# EasyEDA Pro project STM32VG.eprj

# Schematic STM32VG

## Sheets
1 Core: Board Name: STM32VG; Create Date: 2023-02-07; Page Name: Core; Project Name: STM32VG; Schematic Name: STM32VG; Update Date: 2025-08-18; Company: 嘉立创EDA; Page Size: A4; Version: V1.0
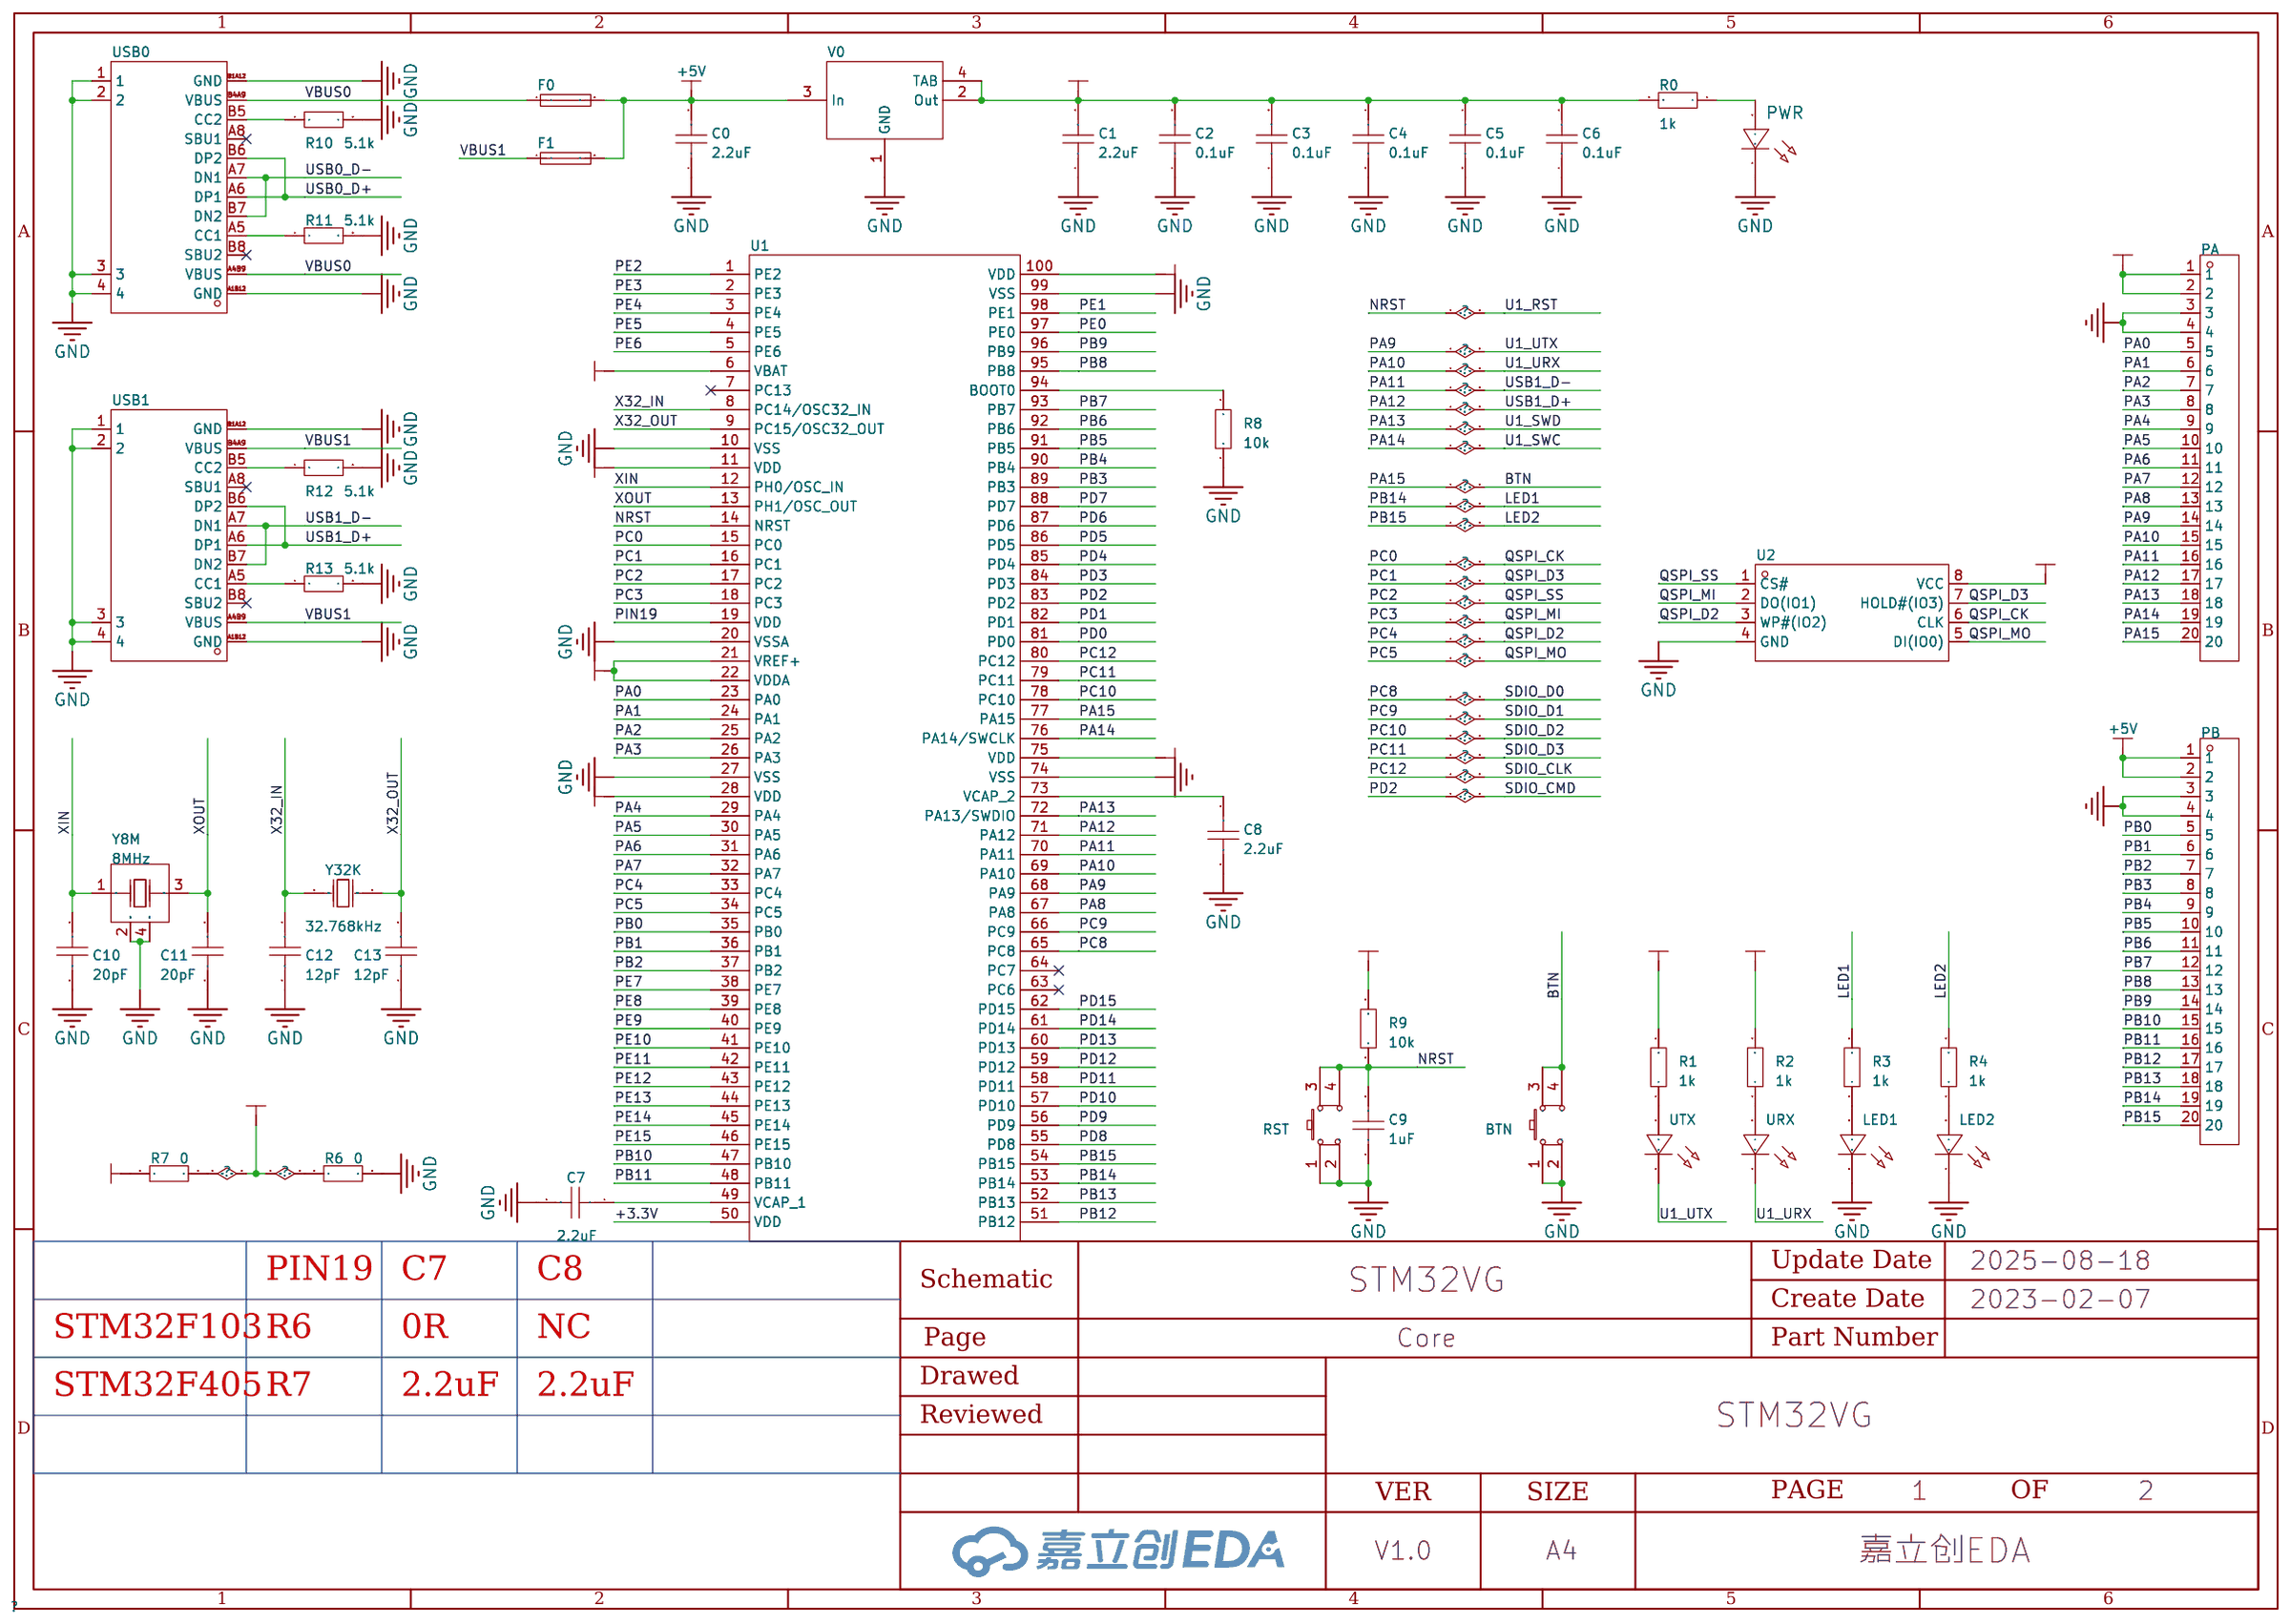
[diagram p0: Core]
2 Peripheral: Page Name: Peripheral
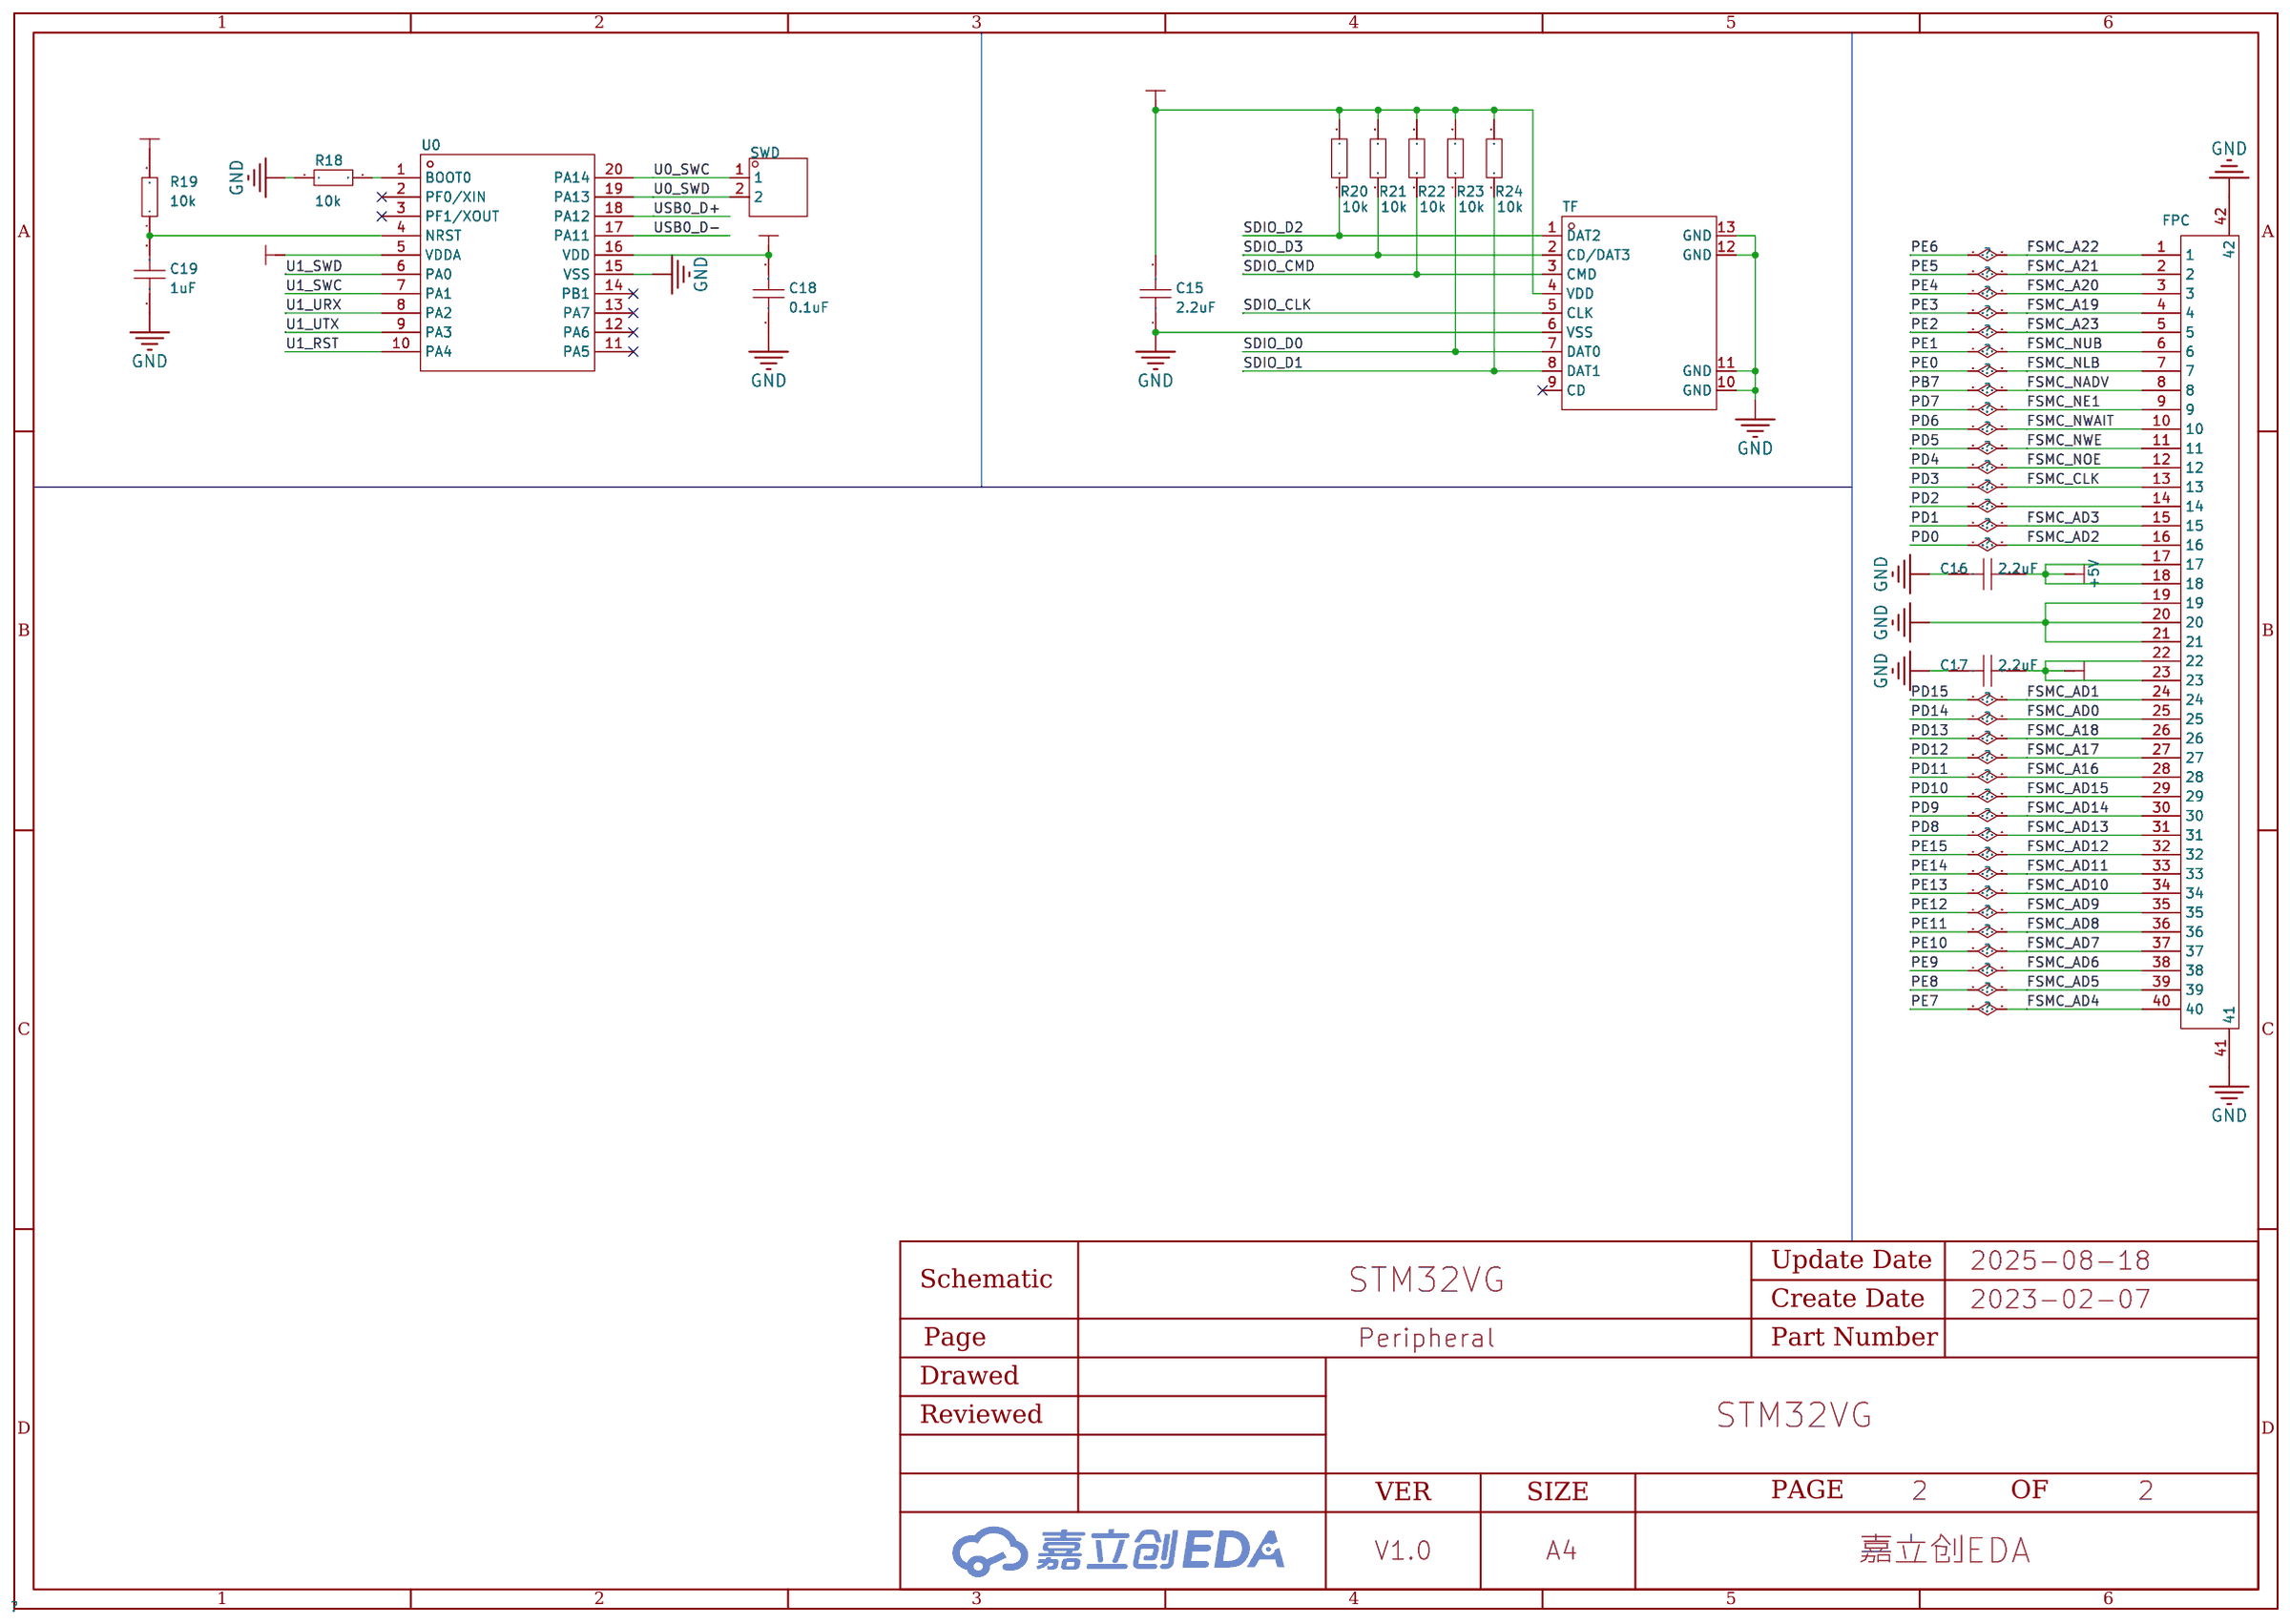
[diagram p1: Peripheral]

## Parts
sheet Core
BTN  PTS815SJK250SMTRLFS  [SW-SMD_4P-L4.2-W3.3-P2.15-LS5.1]
C0  2.2uF  [C0603]
C1  2.2uF  [C0603]
C2  0.1uF  [C0603]
C3  0.1uF  [C0603]
C4  0.1uF  [C0603]
C5  0.1uF  [C0603]
C6  0.1uF  [C0603]
C7  2.2uF  [C0603]
C8  2.2uF  [C0603]
C9  1uF  [C0603]
C10  20pF  [C0603]
C11  20pF  [C0603]
C12  12pF  [C0603]
C13  12pF  [C0603]
F0  JK-nSMD100-16  [F1206]
F1  JK-nSMD100-16  [F1206]
LED1  -  [LED0603-RD_BLUE]
LED2  -  [LED0603-RD_BLUE]
PA  -  [HDR-TH_20P-P2.54-V-M-1]
PB  -  [HDR-TH_20P-P2.54-V-M-1]
PWR  -  [LED0603-RD_BLUE]
R0  1k  [R0603]
R1  1k  [R0603]
R2  1k  [R0603]
R3  1k  [R0603]
R4  1k  [R0603]
R6  0  [R0603]
R7  0  [R0603]
R8  10k  [R0603]
R9  10k  [R0603]
R10  5.1k  [R0603]
R11  5.1k  [R0603]
R12  5.1k  [R0603]
R13  5.1k  [R0603]
RST  PTS815SJK250SMTRLFS  [SW-SMD_4P-L4.2-W3.3-P2.15-LS5.1]
U1  STM32F405VGT6  [LQFP-100_L14.0-W14.0-P0.50-LS16.0-BL]
U2  W25Q64JVSSIQ  [SOIC-8_L5.3-W5.3-P1.27-LS8.0-BL]
URX  -  [LED0603-RD]
USB0  USB-TYPE-C-017  [USB-TYPE-C-SMD_C9900008089]
USB1  USB-TYPE-C-017  [USB-TYPE-C-SMD_C9900008089]
UTX  -  [LED0603-RD]
V0  1117-3.3  [SOT-223-3_L6.4-W3.5-P2.30-LS7.0-BR]
Y8M  8MHz  [CRYSTAL-SMD_4P-L3.2-W2.5-BL]
Y32K  32.768kHz  [OSC-SMD_L3.2-W1.5]
sheet Peripheral
C15  2.2uF  [C0603]
C16  2.2uF  [C0603]
C17  2.2uF  [C0603]
C18  0.1uF  [C0603]
C19  1uF  [C0603]
FPC  AFC01-S40FCA-00  [FPC-SMD_P0.50-40P_FGS-XJ-H2.0]
R18  10k  [R0603]
R19  10k  [R0603]
R20  10k  [R0603]
R21  10k  [R0603]
R22  10k  [R0603]
R23  10k  [R0603]
R24  10k  [R0603]
SWD  -  [HDR-TH_2P-P2.54-V-M-1]
TF  TF-01  [TF-SMD_TF-02]
U0  -  [TSSOP-20_L6.5-W4.4-P0.65-LS6.4-BL]

## Library data of the parts
BTN RST = PTS815SJK250SMTRLFS: 操作寿命10万次，使用温度-20°C 至 70°C,尺寸4.20mmx3.20mmx2.50mm，操作力度2.5N; LCSC Part Name: 轻触开关; Supplier Part: C918859; Manufacturer: C&K; Supplier Footprint: SMD; JLCPCB Part Class: 扩展库; Datasheet: https://atta.szlcsc.com/upload/public/pdf/source/20190916/C411883_4F77F16E1D8E48DC707D8949CEE7CF80.pdf; Supplier: LCSC
C0-C13 C15-C19 = CAP_0603: 容值:100nF;精度:±10%;额定电压:50V;温度系数:X7R;; Supplier Footprint: 0603
F0 F1 = JK-nSMD100-16: LCSC Part Name: 16V 1A 1206自恢复; Supplier Part: C369161; Manufacturer: JK(金科); Supplier Footprint: 1206; JLCPCB Part Class: 扩展库; Datasheet: https://atta.szlcsc.com/upload/public/pdf/source/20190807/C409806_27B0F7EFFA3D5CEE60CCD1EE0A933E0A.pdf; Supplier: LCSC; Voltage - Max: 16V; Current - Max: 100A; Hold Current: 1A; Trip Current: 1.8A; Time to Trip(Max): 300ms
LED1 LED2 = LED_0603-B: 照明颜色:蓝色;主波长/色坐标:465~475nm;; Supplier Footprint: 0603; Supplier Part: C72041
PA PB = HDR-M_2.54_1x20P: 间距:2.54mm;总PIN位数:20;排数:1;插针结构:-;行距:-;安装类型:直插;圆针/方针:-;额定电流:-;额定电压:-;配合针长度:-;塑高:-;触头材质:黄铜;触头镀层:-;颜色:黑色;; Supplier Part: C50981; Supplier Footprint: 插件
PWR = LED_0603-R: 发光颜色:红灯;二极管配置:-;透镜颜色:无色透明;主波长:617.5nm;峰值波长:632nm;色温:-;光通量(25时):-;测试电流:5mA;正向电压(VF):2.2V;发光强度:28.5mcd;功率:60mW;发光角度:120°;安装方式:-;工作温度:-40~+85;; Supplier Footprint: 0603; Supplier Part: C72044
R0-R4 R6-R13 R18-R24 = Res_0603: Supplier Footprint: 0603
U1 = STM32F405VG: CPU内核:ARM Cortex-M4;CPU最大主频:168MHz;工作电压范围:1.8V~3.6V;内部振荡器:有;程序 FLASH容量:1MB;RAM总容量:192KB;EEPROM/数据 FLASH容量:-;GPIO端口数量:82;ADC(单元数/通道数/位数):1@x16ch/12bit;DAC(单元数/通道数/位数):1@x2ch/12bit;外设/功能/协议栈:DMA；LCD/LED驱动；PWM；看门狗;工作温度范围:-40℃~+85℃;; LCSC Part Name: ARM Cortex-M4 168MHz 闪存：1MB RAM：192KB; Supplier Part: C56621; Manufacturer: ST(意法半导体); Supplier Footprint: LQFP-100(14x14); JLCPCB Part Class: 扩展库; Datasheet: https://atta.szlcsc.com/upload/public/pdf/source/20150910/1457707351424.pdf; Supplier: LCSC; CPU Core: ARM Cortex-M4; Maximum Frequency: 168MHz; Supply Voltage Range: 1.8V~3.6V; Internal Oscillator: 有; Program FLASH Size: 1MB; RAM Size: 192KB; GPIO Ports Number: 82; ADC (Units/Channels/bits): 1@x16ch/12bit; DAC (Units/Channels/bits): 1@x2ch/12bit; Peripherals / Functions / Protocol Stacks: DMA；LCD/LED驱动；PWM；看门狗; Operating Temperature Range: -40℃~+85℃
U2 = W25Q64JVSS: Supplier Part: C179171; Manufacturer: WINBOND(华邦); Supplier Footprint: SOIC-8-208mil; JLCPCB Part Class: 扩展库; Datasheet: https://atta.szlcsc.com/upload/public/pdf/source/20191218/C179171_92C5C91D0324539EDD8F1160D2E79C0F.pdf; Supplier: LCSC
URX UTX = LED_0603-G: 照明颜色:翠绿;色温 - CCT（K）:-;主波长/色坐标:520~535nm;; Supplier Footprint: 0603; Supplier Part: C72043
USB0 USB1 = USB-TYPE-C-017: 连接器类型:Type-C;标准:-;公母:母座;触点数量:16;端口数量:1;安装方式:卧贴;额定电流 - 电源:3A;工作温度范围:-25~+85;; Supplier Part: C2927037; Manufacturer: DEALON(德艺隆); Supplier Footprint: SMD; JLCPCB Part Class: 扩展库; Datasheet: https://atta.szlcsc.com/upload/public/pdf/source/20211217/653222EE5174722C9DFE2966329956D8.pdf; Supplier: LCSC; Connector Type: Type-C; Gender: 母座; Number of Contacts: 16; Number of Ports: 1; Mounting Style: 卧贴; Current Rating - Power (Max): 3A; Operating Temperature Range: -25~+85
V0 = AMS1117-3.3: LCSC Part Name: 三端稳压器; Supplier Part: C5125088; Manufacturer: IDCHIP(英锐芯); Supplier Footprint: SOT-223; JLCPCB Part Class: 扩展库; Datasheet: https://atta.szlcsc.com/upload/public/pdf/source/20220816/063B23F8025063688804E1CFFCDD269A.pdf; Supplier: LCSC
Y8M = X32258MSB4SI: 频率:8MHz;频率公差:±10ppm;负载电容:20pF;; LCSC Part Name: 8MHz ±10ppm 20pF YSX321SL; Supplier Part: C2682774; Manufacturer: YXC(扬兴晶振); Supplier Footprint: SMD3225-4P; JLCPCB Part Class: 扩展库; Datasheet: https://atta.szlcsc.com/upload/public/pdf/source/20210106/C2682774_0CD4FDA5D9DA3FBEEC23BD607A48E4B0.pdf; Supplier: LCSC; Crystal Type: 贴片无源晶振; Frequency Tolerance: ±10ppm; Frequency Stability: ±30ppm; Load Capacitance: 20pF; Operating Temperature: -40℃~+85℃
Y32K = 7LC32768F12UC: 工作温度:-40~+85;工作温度:-40~+85;频率:32.768kHz;负载电容:12.5pF;晶振类型:贴片无源晶振;频率公差:±20ppm;频率公差:±20ppm;等效串联电阻(ESR):70kΩ;; LCSC Part Name: 32.768KHZ 12.5PF  ±20ppm; Supplier Part: C252398; Manufacturer: SJK(晶科鑫); Supplier Footprint: SMD-3215_2P; JLCPCB Part Class: 扩展库; Datasheet: https://atta.szlcsc.com/upload/public/pdf/source/20180725/C252398_B09721EBC402D2F46F4FCA4EBDD60A31.pdf; Supplier: LCSC; Operating Temperature: -40~+85; Load Capacitance: 12.5pF; Crystal Type: 贴片无源晶振; Frequency Tolerance: ±20ppm; Equivalent Series Resistance (ESR): 70kΩ
FPC = AFC01-S40FCA-00: 间距:0.5mm;触点数量:40;锁定特性:翻盖式;安装类型:卧贴;触点类型:下接;; LCSC Part Name: FPC 0.5MM 40P 翻盖式 H2.0mm 下接; Supplier Part: C262674; Manufacturer: JS(钜硕电子); Supplier Footprint: P=0.5mm; JLCPCB Part Class: 扩展库; Datasheet: https://atta.szlcsc.com/upload/public/pdf/source/20180814/C262674_1AF28B4A53C394BA00EA1A6141614455.pdf; Supplier: LCSC; Pitch: 0.5mm; Number of Contacts: 40; Locking Feature: 翻盖式; Mounting Type: 卧贴; Contact Type: 下接; Height Above Board: 2mm; FFC, FCB Thickness: 0.3mm~0.3mm
SWD = HDR-M_2.54_1x2P: Supplier Part: C124375; Supplier Footprint: 插件
TF = TF-01: 卡连接方式:自弹式;卡类型:MicroSD卡(TF卡);连接器类型:卡座;本体最大高度:2mm;工作温度范围:-;; LCSC Part Name: 自弹式 MicroSD卡(TF卡) 卡座 9P外焊 端子镀金; Supplier Part: C2889257; Manufacturer: Yuandi(台湾元迪); Supplier Footprint: SMD; JLCPCB Part Class: 扩展库; Datasheet: https://atta.szlcsc.com/upload/public/pdf/source/20210830/04E8B8B371F2BAAE2FD01F5A99E06D9E.pdf; Supplier: LCSC; Card Connection Mode: 自弹式; Card Type: MicroSD卡(TF卡); Connector Type: 卡座; Maximum Body Height: 2mm
U0 = AT32F425F8

## Nets
+3.3V: C1.2 C2.2 C3.2 C4.1 C5.1 C6.2 C15.2 C17.2 C18.2 FPC.22 FPC.23 PA.1 PA.2 R0.2 R1.2 R2.2 R7.2 R9.2 R19.2 R20.2 R21.2 R22.2 R23.2 R24.2 TF.4(VDD) U0.5(VDDA) U0.16(VDD) U1.6(VBAT) U1.11(VDD) U1.21(VREF+) U1.22(VDDA) U1.28(VDD) U1.50(VDD) U1.75(VDD) U1.100(VDD) U2.8(VCC) V0.2(Out) V0.4(TAB)
+5V: C0.2 C16.2 F0.2 F1.2 FPC.17 FPC.18 PB.1 PB.2 V0.3(In)
GND: BTN.1 BTN.2 C0.1 C1.1 C2.1 C3.1 C4.2 C5.2 C6.1 C7.2 C8.1 C9.1 C10.2 C11.1 C12.2 C13.1 C15.1 C16.1 C17.1 C18.1 C19.1 FPC.19 FPC.20 FPC.21 FPC.41 FPC.42 LED1.1(C) LED2.1(C) PA.3 PA.4 PB.3 PB.4 PWR.1(C) R6.2 R8.1 R10.2 R11.2 R12.2 R13.2 R18.1 RST.1 RST.2 TF.6(VSS) TF.10(GND) TF.11(GND) TF.12(GND) TF.13(GND) U0.15(VSS) U1.10(VSS) U1.20(VSSA) U1.27(VSS) U1.74(VSS) U1.99(VSS) U2.4(GND) USB0.1 USB0.2 USB0.3 USB0.4 USB0.A1B12(GND) USB0.B1A12(GND) USB1.1 USB1.2 USB1.3 USB1.4 USB1.A1B12(GND) USB1.B1A12(GND) V0.1(GND) Y8M.2(GND) Y8M.4(GND)
VBUS0: F0.1 USB0.A4B9(VBUS) USB0.B4A9(VBUS)
VBUS1: F1.1 USB1.A4B9(VBUS) USB1.B4A9(VBUS)
BTN: BTN.3 BTN.4 PA.20 U1.77(PA15)
FSMC_A16: FPC.28 U1.58(PD11)
FSMC_A17: FPC.27 U1.59(PD12)
FSMC_A18: FPC.26 U1.60(PD13)
FSMC_A19: FPC.4 U1.2(PE3)
FSMC_A20: FPC.3 U1.3(PE4)
FSMC_A21: FPC.2 U1.4(PE5)
FSMC_A22: FPC.1 U1.5(PE6)
FSMC_A23: FPC.5 U1.1(PE2)
FSMC_AD0: FPC.25 U1.61(PD14)
FSMC_AD1: FPC.24 U1.62(PD15)
FSMC_AD2: FPC.16 U1.81(PD0)
FSMC_AD3: FPC.15 U1.82(PD1)
FSMC_AD4: FPC.40 U1.38(PE7)
FSMC_AD5: FPC.39 U1.39(PE8)
FSMC_AD6: FPC.38 U1.40(PE9)
FSMC_AD7: FPC.37 U1.41(PE10)
FSMC_AD8: FPC.36 U1.42(PE11)
FSMC_AD9: FPC.35 U1.43(PE12)
FSMC_AD10: FPC.34 U1.44(PE13)
FSMC_AD11: FPC.33 U1.45(PE14)
FSMC_AD12: FPC.32 U1.46(PE15)
FSMC_AD13: FPC.31 U1.55(PD8)
FSMC_AD14: FPC.30 U1.56(PD9)
FSMC_AD15: FPC.29 U1.57(PD10)
FSMC_CLK: FPC.13 U1.84(PD3)
FSMC_NADV: FPC.8 PB.12 U1.93(PB7)
FSMC_NE1: FPC.9 U1.88(PD7)
FSMC_NLB: FPC.7 U1.97(PE0)
FSMC_NOE: FPC.12 U1.85(PD4)
FSMC_NUB: FPC.6 U1.98(PE1)
FSMC_NWAIT: FPC.10 U1.87(PD6)
FSMC_NWE: FPC.11 U1.86(PD5)
LED1: PB.19 R3.2 U1.53(PB14)
LED2: PB.20 R4.2 U1.54(PB15)
NRST: C9.2 R9.1 RST.3 RST.4 U0.10(PA4) U1.14(NRST)
PA0: PA.5 U1.23(PA0)
PA1: PA.6 U1.24(PA1)
PA2: PA.7 U1.25(PA2)
PA3: PA.8 U1.26(PA3)
PA4: PA.9 U1.29(PA4)
PA5: PA.10 U1.30(PA5)
PA6: PA.11 U1.31(PA6)
PA7: PA.12 U1.32(PA7)
PA8: PA.13 U1.67(PA8)
PA9: PA.14 U0.9(PA3) U1.68(PA9) UTX.1(C)
PA10: PA.15 U0.8(PA2) U1.69(PA10) URX.1(C)
PA11: PA.16 U1.70(PA11) USB1.A7(DN1) USB1.B7(DN2)
PA12: PA.17 U1.71(PA12) USB1.A6(DP1) USB1.B6(DP2)
PA13: PA.18 U0.6(PA0) U1.72(PA13/SWDIO)
PA14: PA.19 U0.7(PA1) U1.76(PA14/SWCLK)
PB0: PB.5 U1.35(PB0)
PB1: PB.6 U1.36(PB1)
PB2: PB.7 U1.37(PB2)
PB3: PB.8 U1.89(PB3)
PB4: PB.9 U1.90(PB4)
PB5: PB.10 U1.91(PB5)
PB6: PB.11 U1.92(PB6)
PB8: PB.13 U1.95(PB8)
PB9: PB.14 U1.96(PB9)
PB10: PB.15 U1.47(PB10)
PB11: PB.16 U1.48(PB11)
PB12: PB.17 U1.51(PB12)
PB13: PB.18 U1.52(PB13)
PC0: U1.15(PC0) U2.6(CLK)
PC1: U1.16(PC1) U2.7(HOLD#(IO3))
PC2: U1.17(PC2) U2.1(CS#)
PC3: U1.18(PC3) U2.2(DO(IO1))
PC4: U1.33(PC4) U2.3(WP#(IO2))
PC5: U1.34(PC5) U2.5(DI(IO0))
PC8: R23.1 TF.7(DAT0) U1.65(PC8)
PC9: R24.1 TF.8(DAT1) U1.66(PC9)
PC10: R20.1 TF.1(DAT2) U1.78(PC10)
PC11: R21.1 TF.2(CD/DAT3) U1.79(PC11)
PC12: TF.5(CLK) U1.80(PC12)
PD2: FPC.14 R22.1 TF.3(CMD) U1.83(PD2)
PIN19: R6.1 R7.1 U1.19(VDD)
U0_SWC: SWD.1 U0.20(PA14)
U0_SWD: SWD.2 U0.19(PA13)
USB0_D+: U0.18(PA12) USB0.A6(DP1) USB0.B6(DP2)
USB0_D-: U0.17(PA11) USB0.A7(DN1) USB0.B7(DN2)
X32_IN: C12.1 U1.8(PC14/OSC32_IN) Y32K.1(OSC1)
X32_OUT: C13.2 U1.9(PC15/OSC32_OUT) Y32K.2(OSC2)
XIN: C10.1 U1.12(PH0/OSC_IN) Y8M.1(OSC1)
XOUT: C11.2 U1.13(PH1/OSC_OUT) Y8M.3(OSC2)
$1N5592: R11.1 USB0.A5(CC1)
$1N5593: R10.1 USB0.B5(CC2)
$1N5603: PWR.2(A) R0.1
$1N5607: R13.1 USB1.A5(CC1)
$1N5608: R12.1 USB1.B5(CC2)
$1N5646: C7.1 U1.49(VCAP_1)
$1N5664: C8.2 U1.73(VCAP_2)
$1N5769: R8.2 U1.94(BOOT0)
$1N55185: R1.1 UTX.2(A)
$1N55189: R2.1 URX.2(A)
$1N55194: LED1.2(A) R3.1
$1N55209: LED2.2(A) R4.1
$2N25575: R18.2 U0.1(BOOT0)
$2N25582: C19.2 R19.1 U0.4(NRST)

Not connected (* = marked no-connect by the designer): TF 9(CD)*; U0 2(PF0/XIN)* 3(PF1/XOUT)* 11(PA5)* 12(PA6)* 13(PA7)* 14(PB1)*; U1 7(PC13)* 63(PC6)* 64(PC7)*; USB0 A8(SBU1)* B8(SBU2)*; USB1 A8(SBU1)* B8(SBU2)*

## Notes on the sheets
sheet 1
- PIN19
- C7
- C8
- STM32F103
- R6
- 0R
- NC
- STM32F405
- R7
- 2.2uF
- 2.2uF

# Board STM32VG
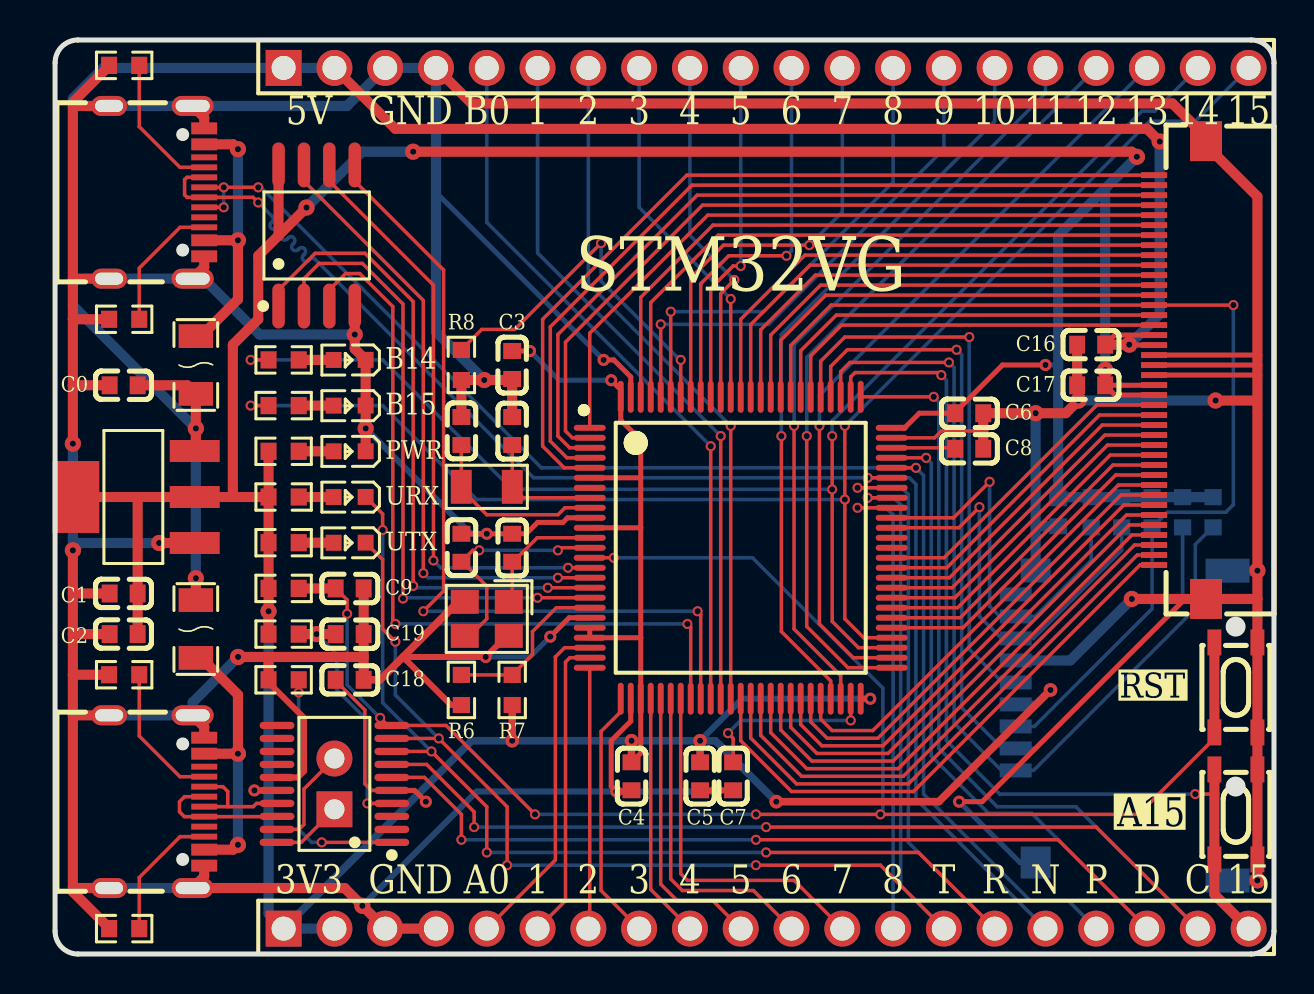
[diagram p2: board, top side]
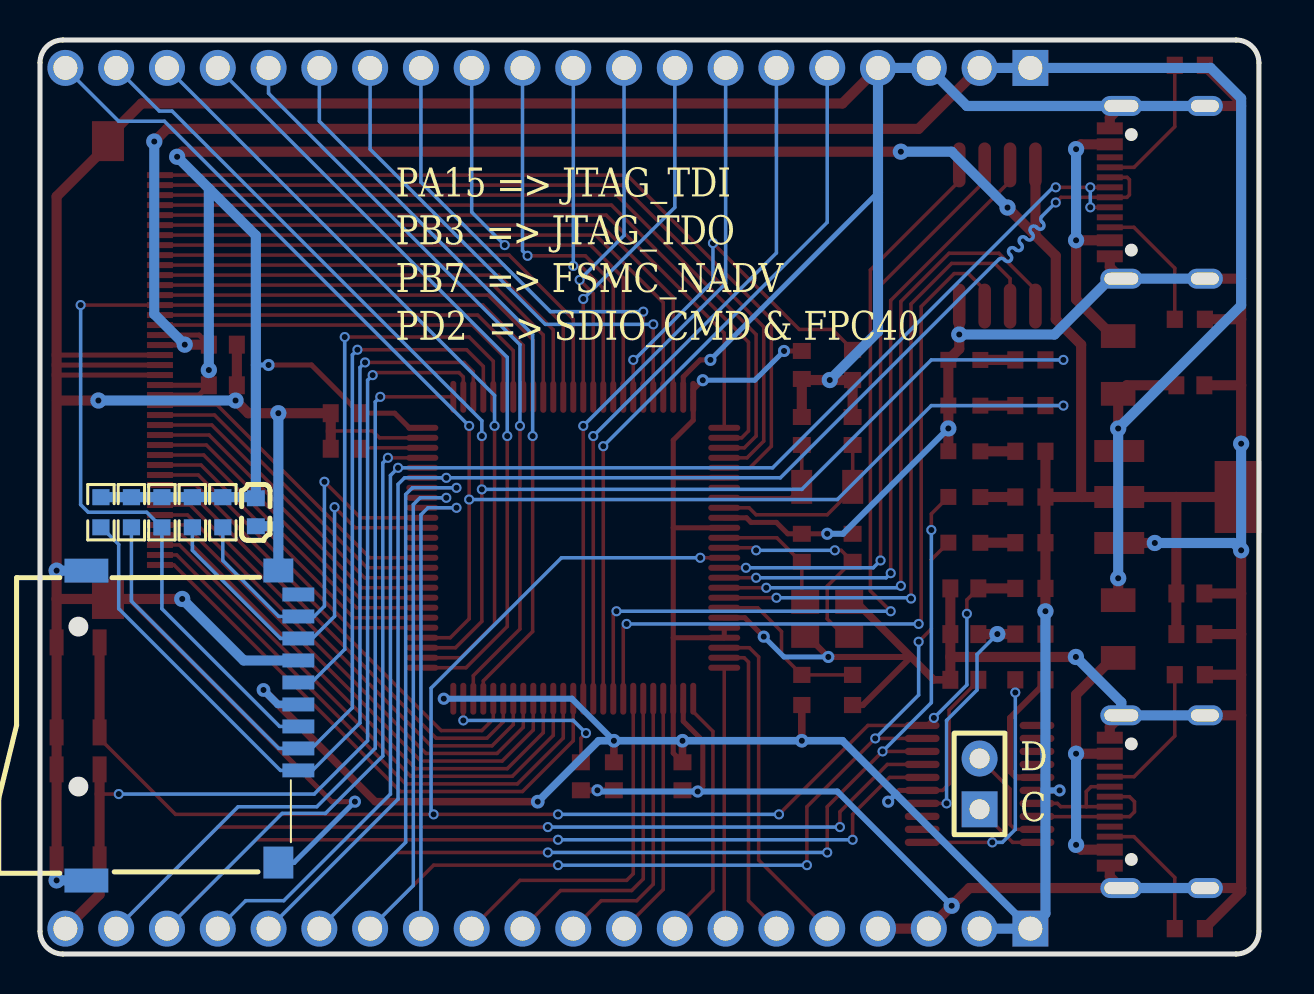
[diagram p3: board, bottom side, seen from below]

Outline 60.96 x 45.72 mm; copper layers: Top Layer, Bottom Layer. Coordinates in mm from the lower left corner of the outline.
Outline path: 0,44.58 0,1.14 arc(0.33,0.33) 1.14,0 59.82,0 arc(60.63,0.33) 60.96,1.14 60.96,44.58 arc(60.63,45.39) 59.82,45.72 1.14,45.72 arc(0.33,45.39) 0,44.58
Stack: Top Layer 0.035mm / Dielectric1 1.51mm FR4 er 4.5 / Bottom Layer 0.035mm

## Design rules (mm)
spacing safeClearance (default): track to track 0.152, other pairs 0.152 to 0.3
track width trackWidth (default): min 0.178, default 0.203, max 0.508
differential pair differentialPair (default): width min 0.127, default 0.254, max 2.54; gap min 0.152, default 0.152
via viaSize (default): diameter min 0.457, default 0.508, max 0.813; hole min 0.305, default 0.305, max 0.305

## Placement (name value [footprint] x y rotation side)
BTN  PTS815SJK250SMTRLFS  [SW-SMD_4P-L4.2-W3.3-P2.15-LS5.1]  59.06 6.98 270 top
C0  2.2uF  [C0603]  3.43 28.45 0 top
C1  2.2uF  [C0603]  3.43 18.03 0 top
C2  0.1uF  [C0603]  3.43 16 0 top
C3  0.1uF  [C0603]  22.86 29.46 90 top
C4  0.1uF  [C0603]  28.83 8.89 270 top
C5  0.1uF  [C0603]  32.26 8.89 270 top
C6  0.1uF  [C0603]  45.72 27.05 180 top
C7  2.2uF  [C0603]  33.91 8.89 270 top
C8  2.2uF  [C0603]  45.72 25.27 180 top
C9  1uF  [C0603]  14.73 18.29 180 top
C10  20pF  [C0603]  22.86 20.32 90 top
C11  20pF  [C0603]  20.32 20.32 270 top
C12  12pF  [C0603]  22.86 26.16 90 top
C13  12pF  [C0603]  20.32 26.16 270 top
C15  2.2uF  [C0603]  50.16 22.1 90 bottom
C16  2.2uF  [C0603]  51.82 30.48 0 top
C17  2.2uF  [C0603]  51.82 28.45 0 top
C18  0.1uF  [C0603]  14.73 13.72 180 top
C19  1uF  [C0603]  14.73 16 180 top
F0  JK-nSMD100-16  [F1206]  7.04 16.26 90 top
F1  JK-nSMD100-16  [F1206]  7.04 29.46 270 top
FPC  AFC01-S40FCA-00  [FPC-SMD_P0.50-40P_FGS-XJ-H2.0]  56.26 29.21 270 top
LED1  -  [LED0603-RD_BLUE]  14.73 29.72 180 top
LED2  -  [LED0603-RD_BLUE]  14.73 27.43 180 top
PA  -  [HDR-TH_20P-P2.54-V-M-1]  35.56 1.27 0 top
PB  -  [HDR-TH_20P-P2.54-V-M-1]  35.56 44.32 0 top
PWR  -  [LED0603-RD_BLUE]  14.73 25.15 180 top
R0  1k  [R0603]  11.43 25.15 180 top
R1  1k  [R0603]  11.43 20.57 180 top
R2  1k  [R0603]  11.43 22.86 180 top
R3  1k  [R0603]  11.43 29.72 180 top
R4  1k  [R0603]  11.43 27.43 180 top
R6  0  [R0603]  20.32 13.21 270 top
R7  0  [R0603]  22.86 13.21 270 top
R8  10k  [R0603]  20.32 29.46 90 top
R9  10k  [R0603]  11.43 18.29 180 top
R10  5.1k  [R0603]  3.45 1.27 180 top
R11  5.1k  [R0603]  3.45 13.97 180 top
R12  5.1k  [R0603]  3.45 31.75 180 top
R13  5.1k  [R0603]  3.45 44.45 180 top
R18  10k  [R0603]  11.43 13.72 0 top
R19  10k  [R0603]  11.43 16 180 top
R20  10k  [R0603]  57.91 22.1 90 bottom
R21  10k  [R0603]  56.39 22.1 90 bottom
R22  10k  [R0603]  54.86 22.1 90 bottom
R23  10k  [R0603]  53.34 22.1 90 bottom
R24  10k  [R0603]  51.82 22.1 90 bottom
RST  PTS815SJK250SMTRLFS  [SW-SMD_4P-L4.2-W3.3-P2.15-LS5.1]  59.06 13.33 270 top
SWD  -  [HDR-TH_2P-P2.54-V-M-1]  13.97 8.51 90 bottom
TF  TF-01  [TF-SMD_TF-02]  53.34 11.43 270 bottom
U0  -  [TSSOP-20_L6.5-W4.4-P0.65-LS6.4-BL]  13.97 8.51 90 top
U1  STM32F405VGT6  [LQFP-100_L14.0-W14.0-P0.50-LS16.0-BL]  34.29 20.32 270 top
U2  W25Q64JVSSIQ  [SOIC-8_L5.3-W5.3-P1.27-LS8.0-BL]  13.08 35.94 0 top
URX  -  [LED0603-RD]  14.73 22.86 180 top
USB0  USB-TYPE-C-017  [USB-TYPE-C-SMD_C9900008089]  5.08 7.62 270 top
USB1  USB-TYPE-C-017  [USB-TYPE-C-SMD_C9900008089]  5.08 38.1 270 top
UTX  -  [LED0603-RD]  14.73 20.57 180 top
V0  1117-3.3  [SOT-223-3_L6.4-W3.5-P2.30-LS7.0-BR]  4.01 22.86 0 top
Y8M  8MHz  [CRYSTAL-SMD_4P-L3.2-W2.5-BL]  21.59 16.76 180 top
Y32K  32.768kHz  [OSC-SMD_L3.2-W1.5]  21.59 23.37 180 top

## Footprints (pads in the part's own frame, mm; a bottom-side part is the same pattern mirrored in y, then rotated)
C0603
  rect 0.8x0.9 smd: 1(-0.7,0) 2(0.7,0)
CRYSTAL-SMD_4P-L3.2-W2.5-BL
  rect 1.4x1.2 smd: 1(-1.1,-0.85) 2(1.1,-0.85) 3(1.1,0.85) 4(-1.1,0.85)
F1206
  rect 1.19x1.728 smd: 1(-1.445,0) 2(1.445,0)
FPC-SMD_P0.50-40P_FGS-XJ-H2.0
  rect 0.3x1.3 smd: 1(-9.75,-1.3) 2(-9.25,-1.3) 3(-8.75,-1.3) 4(-8.25,-1.3) 5(-7.75,-1.3) 6(-7.25,-1.3) 7(-6.75,-1.3) 8(-6.25,-1.3) 9(-5.75,-1.3) 10(-5.25,-1.3) 11(-4.75,-1.3) 12(-4.25,-1.3) 13(-3.75,-1.3) 14(-3.25,-1.3) 15(-2.75,-1.3) 16(-2.25,-1.3) 17(-1.75,-1.3) 18(-1.25,-1.3) 19(-0.75,-1.3) 20(-0.25,-1.3) 21(0.25,-1.3) 22(0.75,-1.3) 23(1.25,-1.3) 24(1.75,-1.3) 25(2.25,-1.3) 26(2.75,-1.3) 27(3.25,-1.3) 28(3.75,-1.3) 29(4.25,-1.3) 30(4.75,-1.3) 31(5.25,-1.3) 32(5.75,-1.3) 33(6.25,-1.3) 34(6.75,-1.3) 35(7.25,-1.3) 36(7.75,-1.3) 37(8.25,-1.3) 38(8.75,-1.3) 39(9.25,-1.3) 40(9.75,-1.3)
  rect 2x1.6 smd: 41(11.45,1.3) 42(-11.45,1.3)
HDR-TH_2P-P2.54-V-M-1
  rect 1.8x1.8 hole 1: 1(-1.27,0)
  round 1.8 hole 1: 2(1.27,0)
HDR-TH_20P-P2.54-V-M-1
  rect 1.801x1.801 hole 1.199: 1(-24.13,0)
  round 1.801 hole 1.199: 2(-21.59,0) 3(-19.05,0) 4(-16.51,0) 5(-13.97,0) 6(-11.43,0) 7(-8.89,0) 8(-6.35,0) 9(-3.81,0) 10(-1.27,0) 11(1.27,0) 12(3.81,0) 13(6.35,0) 14(8.89,0) 15(11.43,0) 16(13.97,0) 17(16.51,0) 18(19.05,0) 19(21.59,0) 20(24.13,0)
LED0603-RD
  rect 0.8x0.8 smd: 1(-0.799,-0.004) 2(0.799,0.004)
LED0603-RD_BLUE
  rect 0.8x0.8 smd: 1(-0.8,-0.003) 2(0.8,0.003)
LQFP-100_L14.0-W14.0-P0.50-LS16.0-BL
  oval 0.3x1.6 smd: 1(-6,-7.55) 2(-5.5,-7.55) 3(-5,-7.55) 4(-4.5,-7.55) 5(-4,-7.55) 6(-3.5,-7.55) 7(-3,-7.55) 8(-2.5,-7.55) 9(-2,-7.55) 10(-1.5,-7.55) 11(-1,-7.55) 12(-0.5,-7.55) 13(0,-7.55) 14(0.5,-7.55) 15(1,-7.55) 16(1.5,-7.55) 17(2,-7.55) 18(2.5,-7.55) 19(3,-7.55) 20(3.5,-7.55) 21(4,-7.55) 22(4.5,-7.55) 23(5,-7.55) 24(5.5,-7.55) 25(6,-7.55) 51(6,7.55) 52(5.5,7.55) 53(5,7.55) 54(4.5,7.55) 55(4,7.55) 56(3.5,7.55) 57(3,7.55) 58(2.5,7.55) 59(2,7.55) 60(1.5,7.55) 61(1,7.55) 62(0.5,7.55) 63(0,7.55) 64(-0.5,7.55) 65(-1,7.55) 66(-1.5,7.55) 67(-2,7.55) 68(-2.5,7.55) 69(-3,7.55) 70(-3.5,7.55) 71(-4,7.55) 72(-4.5,7.55) 73(-5,7.55) 74(-5.5,7.55) 75(-6,7.55)
  oval 1.6x0.3 smd: 26(7.55,-6) 27(7.55,-5.5) 28(7.55,-5) 29(7.55,-4.5) 30(7.55,-4) 31(7.55,-3.5) 32(7.55,-3) 33(7.55,-2.5) 34(7.55,-2) 35(7.55,-1.5) 36(7.55,-1) 37(7.55,-0.5) 38(7.55,0) 39(7.55,0.5) 40(7.55,1) 41(7.55,1.5) 42(7.55,2) 43(7.55,2.5) 44(7.55,3) 45(7.55,3.5) 46(7.55,4) 47(7.55,4.5) 48(7.55,5) 49(7.55,5.5) 50(7.55,6) 76(-7.55,6) 77(-7.55,5.5) 78(-7.55,5) 79(-7.55,4.5) 80(-7.55,4) 81(-7.55,3.5) 82(-7.55,3) 83(-7.55,2.5) 84(-7.55,2) 85(-7.55,1.5) 86(-7.55,1) 87(-7.55,0.5) 88(-7.55,0) 89(-7.55,-0.5) 90(-7.55,-1) 91(-7.55,-1.5) 92(-7.55,-2) 93(-7.55,-2.5) 94(-7.55,-3) 95(-7.55,-3.5) 96(-7.55,-4) 97(-7.55,-4.5) 98(-7.55,-5) 99(-7.55,-5.5) 100(-7.55,-6)
OSC-SMD_L3.2-W1.5
  rect 1.049x1.7 smd: 1(-1.275,0) 2(1.275,0)
R0603
  rect 0.806x0.864 smd: 1(-0.753,0) 2(0.753,0)
SOIC-8_L5.3-W5.3-P1.27-LS8.0-BL
  oval 0.63x2.25 smd: 1(-1.905,-3.53) 2(-0.635,-3.53) 3(0.635,-3.53) 4(1.905,-3.53) 5(1.905,3.53) 6(0.635,3.53) 7(-0.635,3.53) 8(-1.905,3.53)
SOT-223-3_L6.4-W3.5-P2.30-LS7.0-BR
  rect 2.5x1.1 smd: 1(2.97,-2.3) 2(2.97,0) 3(2.97,2.3)
  rect 2.34x3.6 smd: 4(-2.97,0)
SW-SMD_4P-L4.2-W3.3-P2.15-LS5.1
  rect 1.3x0.701 smd: 1(-2.251,1.075) 2(2.251,1.075) 3(-2.251,-1.075) 4(2.251,-1.075)
TF-SMD_TF-02
  rect 0.7x1.6 smd: 1(2.245,5.3) 2(1.145,5.3) 3(0.046,5.3) 4(-1.054,5.3) 5(-2.155,5.3) 6(-3.255,5.3) 7(-4.354,5.3) 8(-5.454,5.3) 9(-6.554,5.3)
  rect 1.2x1.5 smd: 10(-7.754,4.3)
  rect 1.2x2.2 smd: 11(-7.746,-5.3) 12(7.754,-5.3)
  rect 1.6x1.5 smd: 13(6.854,4.3)
TSSOP-20_L6.5-W4.4-P0.65-LS6.4-BL
  oval 0.364x1.742 smd: 1(-2.925,-2.871) 2(-2.275,-2.871) 3(-1.625,-2.871) 4(-0.975,-2.871) 5(-0.325,-2.871) 6(0.325,-2.871) 7(0.975,-2.871) 8(1.625,-2.871) 9(2.275,-2.871) 10(2.925,-2.871) 11(2.925,2.871) 12(2.275,2.871) 13(1.625,2.871) 14(0.975,2.871) 15(0.325,2.871) 16(-0.325,2.871) 17(-0.975,2.871) 18(-1.625,2.871) 19(-2.275,2.871) 20(-2.925,2.871)
USB-TYPE-C-SMD_C9900008089
  oval 1x2.1 hole 0.6x1.7: 1(-4.32,1.801) 2(4.32,1.801)
  oval 1x1.8 hole 0.6x1.4: 3(-4.32,-2.379) 4(4.32,-2.379)
  rect 0.6x1.3 smd: A1B12(-3.2,2.379) A4B9(-2.4,2.379) B1A12(3.2,2.379) B4A9(2.4,2.379)
  rect 0.3x1.3 smd: A5(-1.25,2.379) A6(-0.25,2.379) A7(0.25,2.379) A8(1.25,2.379) B5(1.75,2.379) B6(0.75,2.379) B7(-0.75,2.379) B8(-1.75,2.379)

## Nets
As in the schematic.

Pads without a net: TF 9; U0 2 3 11 12 13 14; U1 7 63 64; USB0 A8 B8; USB1 A8 B8

## Via types
v1: diameter 0.813, hole 0.305, Top Layer to Bottom Layer, 28 vias
v2: diameter 0.61, hole 0.305, Top Layer to Bottom Layer, 13 vias
v3: diameter 0.686, hole 0.305, Top Layer to Bottom Layer, 5 vias
v4: diameter 0.508, hole 0.305, Top Layer to Bottom Layer, 78 vias

## Routing (per net, layer and track width the routed paths; a pad name or vN(x,y) marks a point on that pad's centre or on a via; arc(x,y) is an arc through that point)
+3.3V: length 264.7
  Top Layer w0.178: C18.2 14.03,13.67 15.49,12.2 15.49,8.51 15.82,8.18 U0.5
  Top Layer w0.254: v2(18.54,7.62) 17.98,8.18 U0.5 ; 29.29,15.82 U1.28 29.29,10.05 C4.1 ; 29.29,15.82 U1.22 U1.21 ; 29.29,15.82 29.29,21.32 ; 29.29,23.82 29.29,21.32 ; 29.29,23.82 29.29,25.7 28.29,26.7 U1.100 28.29,28.22 v2(27.81,28.7) ; 29.29,23.82 U1.6 ; 29.29,21.32 U1.11 ; U1.75 42.49,26.32 43.22,27.05 C6.2 45.02,27.1 47.38,29.46 v2(49.53,29.46) ; C3.2 v2(23.75,30.16) ; FPC.23 53,27.96 C17.2 54.95,28.45 FPC.22
  Top Layer w0.305: v2(9.97,8.18) U0.16 ; U1.50 v2(40.77,12.77)
  Top Layer w0.381: R7.2 v3(22.86,10.67) ; v3(36.07,7.62) 44.2,7.62 v3(49.78,13.21) ; C5.1 v3(32.26,10.67) ; v3(28.83,10.67) C4.1
  Top Layer w0.508: V0.4 4.13,22.86 ; 4.13,22.86 V0.2 8.85,22.86 ; 4.13,22.86 C1.2 C2.2 ; 11.18,35.94 v1(12.57,37.34) ; 11.18,35.94 U2.8 ; 11.18,35.94 10.16,34.92 10.16,31.75 8.89,30.48 8.89,22.9 8.85,22.86 ; 8.85,22.86 R2.2 ; v1(17.91,40.13) 53.85,40.13 v1(54.1,39.88) ; C17.2 v1(52.52,29.21) ; R2.2 R1.2 R9.2 R19.2 ; R2.2 R0.2
  Bottom Layer w0.254: v2(49.53,29.46) 50.16,29.46 ; v2(18.54,7.62) 18.17,8 18.16,8 ; v2(23.75,30.16) 25.21,28.7 v2(27.81,28.7)
  Bottom Layer w0.305: v2(40.77,12.77) 34.36,12.77 v3(32.26,10.67) ; v2(9.97,8.18) 10.68,8.18
  Bottom Layer w0.381: v3(36.07,7.62) 33.02,10.67 v3(32.26,10.67) v3(28.83,10.67) v3(22.86,10.67) 20.83,10.67 PA.1 ; v3(49.78,13.21) 49.06,12.48 TF.4
  Bottom Layer w0.508: PA.2 PA.1 10.68,2.02 v1(10.68,17.14) ; R20.2 R21.2 R22.2 R23.2 R24.2 50.22,22.85 C15.2 50.16,35.94 52.52,38.29 ; v1(12.57,37.34) 15.37,40.13 v1(17.91,40.13) ; 52.52,38.29 v1(52.52,29.21) ; 52.52,38.29 v1(54.1,39.88)
+5V: length 106
  Top Layer w0.254: C16.2 53,30.96 FPC.17 ; v1(53.72,30.48) 53.74,30.46 FPC.18
  Top Layer w0.508: V0.3 7.04,25.21 v1(7.04,26.29) F1.2 6.61,28.45 C0.2 ; C16.2 v1(53.72,30.48) ; v1(55.25,40.64) 54.61,41.28 17.02,41.28 PB.2 ; F0.2 v1(7.04,18.8)
  Bottom Layer w0.508: v1(53.72,30.48) 55.25,32 v1(55.25,40.64) ; v1(7.04,18.8) v1(7.04,26.29) 0.89,32.44 0.89,42.8 2.41,44.32 PB.1 PB.2
GND: length 420.2
  Top Layer w0.178: 46.42,26.15 46.41,26.16 44.32,26.16 43.98,25.82 U1.74
  Top Layer w0.254: C11.1 C10.2 23.56,21.02 24.13,21.59 25.4,21.59 25.63,21.82 U1.10 ; v2(28.07,8.13) 27.81,8.38 27.81,10.67 28.79,11.64 U1.27 ; v2(45.21,7.62) 46.37,7.62 56.51,17.76 ; v2(24.76,15.88) 25.71,16.82 U1.20 ; v2(27.43,29.72) 27.94,29.72 28.79,28.87 U1.99 ; FPC.19 60.13,29.96 ; FPC.20 60.13,29.46 ; FPC.21 60.13,28.96
  Top Layer w0.305: C5.2 C7.2 ; v2(28.07,8.13) 28.77,8.13 C4.2 ; Y8M.4 22.59,15.91 v2(21.53,14.86) 17.4,14.86 19.8,12.45 R6.2 ; 10.68,13.71 10.68,13.58 12.45,11.81 12.45,9.14 12.14,8.83 U0.15
  Top Layer w0.381: C18.1 16.26,13.72 20.15,17.61 Y8M.2
  Top Layer w0.508: 0.89,33.78 0.89,31.75 ; 0.89,33.78 USB1.4 ; 0.89,33.78 0.89,42.42 ; 0.89,31.75 0.89,28.45 ; 0.89,31.75 R12.2 ; USB0.B1A12 7.46,3.88 USB0.2 14.48,3.3 v1(15.37,2.41) PA.3 PA.4 ; 10.68,14.86 15.43,14.86 ; 10.68,14.86 v1(9.15,14.86) ; 10.68,14.86 R18.1 ; 15.43,14.86 C19.1 C9.1 ; 15.43,14.86 C18.1 ; C8.1 C6.1 v1(49.04,27.05) 50.55,27.05 v1(51.18,27.69) 51.18,28.38 C17.1 C16.1 ; 0.89,18.03 0.89,16 ; 0.89,18.03 C1.1 ; 0.89,18.03 v1(0.89,20.19) ; 0.89,16 C2.1 ; 0.89,16 0.89,13.97 ; 0.89,28.45 C0.1 ; 0.89,28.45 v1(0.89,25.53) ; 0.89,42.42 USB1.3 ; 0.89,42.42 0.89,42.61 2.7,44.42 R13.2 ; v1(60.13,3.68) BTN.2 BTN.1 RST.2 RST.1 60.13,17.76 ; 60.13,17.76 v1(60.13,19.18) 60.13,37.89 57.56,40.46 FPC.42 57.56,40.86 55.88,42.55 20.83,42.55 PB.4 ; 60.13,17.76 FPC.41 v1(53.85,17.76) ; USB0.4 0.89,3.3 ; 0.89,3.3 0.89,11.94 ; 0.89,3.3 0.89,3.11 2.7,1.3 R10.2 ; v1(58.04,27.69) 60.11,27.69 ; USB0.1 7.46,11.36 USB0.A1B12 ; USB1.1 7.46,41.84 USB1.A1B12 ; 0.89,11.94 0.89,13.97 ; 0.89,11.94 USB0.3 ; PWR.1 LED2.1 LED1.1 14.99,30.27 U2.4 ; USB1.B1A12 7.46,34.36 USB1.2 ; 0.89,13.97 R11.2 ; C13.1 R8.1 22.81,28.71 C3.1 C12.2 ; V0.1 v1(5.21,20.56)
  Bottom Layer w0.254: TF.13 48.26,4.58 v2(45.21,7.62) ; v2(27.43,29.72) 19.05,38.1 ; v2(24.76,15.88) 23.75,14.86 v2(21.53,14.86)
  Bottom Layer w0.305: v1(15.37,2.41) 21.08,8.13 v2(28.07,8.13) 33.02,8.13 v2(33.08,8.19) ; v1(15.53,26.29) 20.8,21.02 v2(21.59,21.02)
  Bottom Layer w0.508: TF.11 60.13,19.18 ; USB1.4 USB1.2 7.43,33.78 10.22,30.99 v1(14.99,30.99) ; USB0.3 USB0.1 6.88,12.59 v1(9.15,14.86) ; v1(0.89,25.53) v1(0.89,20.19) 1.26,20.56 v1(5.21,20.56) ; v1(53.85,17.76) 50.77,14.68 TF.6 ; 49.04,21.4 TF.10 ; 49.04,21.4 C15.1 ; 49.04,21.4 v1(49.04,27.05) ; USB1.3 USB1.1 14.61,42.42 PB.3 PB.4 19.05,31.12 v1(21.46,28.71) ; v1(51.18,27.69) v1(58.04,27.69) ; USB0.4 USB0.2 ; v1(60.13,3.68) 58.65,3.68 TF.12
VBUS0: length 13.8
  Top Layer w0.508: v1(9.14,5.46) 8.9,5.22 USB0.B4A9 ; F0.1 7.31,14.81 9.14,12.97 v1(9.14,10.02) USB0.A4B9
  Bottom Layer w0.508: v1(9.14,10.02) v1(9.14,5.46)
VBUS1: length 13.8
  Top Layer w0.508: USB1.A4B9 8.9,40.5 v1(9.14,40.26) ; F1.1 7.31,30.91 9.14,32.75 v1(9.14,35.7) USB1.B4A9
  Bottom Layer w0.508: v1(9.14,35.7) v1(9.14,40.26)
BTN: length 47.2
  Top Layer w0.178: v4(44.32,28.96) 44.2,29.08 40,29.08 39.79,28.87 U1.77 ; 57.98,8 57.98,8 v4(57.02,8)
  Top Layer w0.508: BTN.3 BTN.4 57.98,2.98 PA.20
  Bottom Layer w0.178: v4(44.32,28.96) 44.58,28.7 44.58,10.67 47.24,8 v4(57.02,8)
FSMC_A16: length 16.3
  Top Layer w0.178: FPC.28 52.64,25.46 45,17.82 U1.58
FSMC_A17: length 16.3
  Top Layer w0.178: U1.59 44.86,18.32 52.5,25.96 FPC.27
FSMC_A18: length 16.3
  Top Layer w0.178: U1.60 44.73,18.82 52.37,26.46 FPC.26
FSMC_A19: length 38.1
  Top Layer w0.178: FPC.4 32.38,37.46 25.53,30.61 25.53,26.16 25.87,25.82 U1.2
FSMC_A20: length 39.6
  Top Layer w0.178: FPC.3 32.12,37.96 25.15,30.99 25.15,25.91 25.73,25.32 U1.3
FSMC_A21: length 41.2
  Top Layer w0.178: FPC.2 31.86,38.46 24.76,31.37 24.76,25.65 25.6,24.82 U1.4
FSMC_A22: length 42.7
  Top Layer w0.178: FPC.1 31.59,38.96 24.38,31.75 24.38,25.4 25.46,24.32 U1.5
FSMC_A23: length 35.4
  Top Layer w0.178: FPC.5 32.64,36.96 26.74,31.06 U1.1
FSMC_AD0: length 16.3
  Top Layer w0.178: U1.61 44.59,19.32 52.23,26.96 FPC.25
FSMC_AD1: length 16.3
  Top Layer w0.178: FPC.24 52.1,27.46 44.46,19.82 U1.62
FSMC_AD2: length 19.9
  Top Layer w0.178: FPC.16 39.33,31.46 37.79,29.92 U1.81
FSMC_AD3: length 20.7
  Top Layer w0.178: U1.82 37.29,30.18 39.07,31.96 FPC.15
FSMC_AD4: length 28.5
  Top Layer w0.178: FPC.40 54.26,19.46 42.93,8.13 36.83,8.13 34.29,10.67 U1.38
FSMC_AD5: length 27.8
  Top Layer w0.178: FPC.39 54.12,19.96 42.67,8.51 37.08,8.51 34.79,10.8 U1.39
FSMC_AD6: length 27.1
  Top Layer w0.178: U1.40 35.29,10.94 37.34,8.89 42.42,8.89 53.99,20.46 FPC.38
FSMC_AD7: length 26.5
  Top Layer w0.178: U1.41 35.79,11.07 37.59,9.27 42.16,9.27 53.85,20.96 FPC.37
FSMC_AD8: length 25.8
  Top Layer w0.178: U1.42 36.29,11.21 37.85,9.65 41.91,9.65 53.72,21.46 FPC.36
FSMC_AD9: length 25.1
  Top Layer w0.178: U1.43 36.79,11.34 38.1,10.03 41.66,10.03 53.58,21.96 FPC.35
FSMC_AD10: length 24.4
  Top Layer w0.178: U1.44 37.29,11.48 38.35,10.41 41.4,10.41 53.45,22.46 FPC.34
FSMC_AD11: length 23.7
  Top Layer w0.178: FPC.33 53.31,22.96 41.15,10.8 38.61,10.8 37.79,11.61 U1.45
FSMC_AD12: length 23
  Top Layer w0.178: U1.46 38.29,11.75 38.86,11.18 40.89,11.18 53.18,23.46 FPC.32
FSMC_AD13: length 16.3
  Top Layer w0.178: U1.55 45.4,16.32 53.04,23.96 FPC.31
FSMC_AD14: length 16.3
  Top Layer w0.178: FPC.30 52.91,24.46 45.27,16.82 U1.56
FSMC_AD15: length 16.3
  Top Layer w0.178: FPC.29 52.77,24.96 45.13,17.32 U1.57
FSMC_CLK: length 22.4
  Top Layer w0.178: U1.84 36.29,30.7 38.55,32.96 FPC.13
FSMC_NADV: length 39.3
  Top Layer w0.178: FPC.8 33.43,35.46 31.79,33.82 U1.93
  Bottom Layer w0.178: v4(37.72,35.46) 39.37,37.11 PB.12
FSMC_NE1: length 25.9
  Top Layer w0.178: FPC.9 37.5,34.96 34.29,31.75 U1.88
FSMC_NLB: length 31.3
  Top Layer w0.178: U1.97 29.79,32.58 33.17,35.96 FPC.7
FSMC_NOE: length 23.3
  Top Layer w0.178: FPC.12 38.29,33.46 35.79,30.96 U1.85
FSMC_NUB: length 32.1
  Top Layer w0.178: FPC.6 32.9,36.46 29.29,32.85 U1.98
FSMC_NWAIT: length 25
  Top Layer w0.178: U1.87 34.79,31.49 37.76,34.46 FPC.10
FSMC_NWE: length 24.2
  Top Layer w0.178: FPC.11 38.02,33.96 35.29,31.23 U1.86
LED1: length 71.8
  Top Layer w0.178: v4(9.78,29.72) R3.2 ; U1.53 40.18,15.32 38.86,16.64 v4(38.86,25.91)
  Bottom Layer w0.178: PB.19 54.99,42.16 54.36,42.16 38.86,26.67 v4(38.86,25.91) ; v4(9.78,29.72) 16.38,29.72 22.86,23.24 v4(38.86,23.24)
LED2: length 72.6
  Top Layer w0.178: v4(39.5,26.42) 39.5,16.76 40.44,15.82 U1.54 ; v4(9.78,27.43) R4.2
  Bottom Layer w0.178: v4(9.78,27.43) 16.38,27.43 21.08,22.73 v4(39.5,22.73) ; PB.20 57.02,41.66 54.74,41.66 v4(39.5,26.42)
NRST: length 83.1
  Top Layer w0.178: C9.2 14.6,17.72 v4(14.6,17.02) ; v4(16.26,11.81) 16.63,11.43 U0.10 19.55,11.43 v4(24,6.98) ; RST.4 57.98,10.78 54.18,6.98 v4(35.05,6.98) ; U1.14 v4(27.94,19.82)
  Top Layer w0.508: RST.3 RST.4 ; R9.1 C9.2
  Bottom Layer w0.178: v4(14.6,17.02) 14.6,13.46 v4(16.26,11.81) ; v4(27.94,19.82) 34.88,19.82 41.4,13.3 41.4,7.11 v4(41.28,6.98) ; v4(24,6.98) v4(35.05,6.98)
PA0: length 16.9
  Top Layer w0.178: PA.5 25.02,4.7 25.02,14.86 25.48,15.32 U1.23
PA1: length 15.2
  Top Layer w0.178: U1.24 25.74,14.82 25.53,14.61 25.53,2.67 PA.6
PA2: length 13.1
  Top Layer w0.178: PA.7 26.74,1.34 U1.25
PA3: length 12.7
  Top Layer w0.178: U1.26 28.29,12.12 27.31,11.14 27.31,3.17 PA.8
PA4: length 12.3
  Top Layer w0.178: U1.29 29.79,3.23 PA.9
PA5: length 14.2
  Top Layer w0.178: PA.10 32.89,2.67 31.12,2.67 30.29,3.49 U1.30
PA6: length 16.1
  Top Layer w0.178: U1.31 30.79,3.75 31.37,3.17 34.93,3.17 PA.11
PA7: length 18
  Top Layer w0.178: PA.12 36.96,3.68 31.62,3.68 31.29,4.02 U1.32
PA8: length 24.3
  Top Layer w0.178: U1.67 v4(40.13,22.32)
  Bottom Layer w0.178: v4(40.13,22.32) 41.56,22.32 41.91,21.97 PA.13
PA9: length 69.7
  Top Layer w0.178: v4(22.61,4.44) 22.61,7.37 v4(19.19,10.78) U0.9 ; UTX.1 16.38,19.73 16.38,16.26 v4(17.02,15.62) ; PA.14 41.28,4.44 v4(35.05,4.44) ; U1.68 v4(40.64,22.82)
  Bottom Layer w0.178: v4(40.64,22.82) 41.95,22.82 42.29,22.48 42.29,3.43 PA.14 ; v4(35.05,4.44) v4(22.61,4.44) ; v4(17.02,15.62) 17.02,12.95 v4(19.19,10.78)
PA10: length 77.1
  Top Layer w0.178: v4(21.59,5.08) 21.59,7.37 v4(18.82,10.13) U0.8 ; URX.1 16.38,22.01 v4(16.38,21.21) ; PA.15 43.18,5.08 v4(35.56,5.08) ; U1.69 v4(40.13,23.32)
  Bottom Layer w0.178: v4(16.38,21.21) 16.38,12.57 v4(18.82,10.13) ; v4(21.59,5.08) v4(35.56,5.08) ; PA.15 42.67,5.59 42.67,22.99 42.34,23.32 v4(40.13,23.32)
PA11: length 72.8
  Top Layer w0.178: v4(10.16,37.59) 9.9,37.85 USB1.A7 7.46,37.85 6.6,37.85 6.48,37.97 6.48,38.73 6.59,38.85 USB1.B7 ; v4(40.64,23.82) U1.70
  Bottom Layer w0.178: v4(10.16,37.59) 10.86,36.9 arc(10.91,36.76) 10.86,36.63 10.81,36.58 arc(10.81,36.31) 11.08,36.31 11.12,36.36 arc(11.39,36.36) 11.39,36.09 11.35,36.04 arc(11.35,35.77) 11.62,35.77 11.66,35.82 arc(11.93,35.82) 11.93,35.55 11.88,35.5 arc(11.88,35.23) 12.15,35.23 12.2,35.28 arc(12.47,35.28) 12.47,35.01 12.42,34.96 arc(12.42,34.69) 12.69,34.69 12.74,34.74 arc(12.88,34.8) 13.01,34.74 23.93,23.82 v4(40.64,23.82) 42.73,23.82 43.05,23.5 43.05,7.75 PA.16
PA12: length 72.5
  Top Layer w0.178: USB1.B6 v4(8.43,37.35) ; U1.71 v4(43.05,24.32) ; USB1.A6 v4(10.16,38.35)
  Bottom Layer w0.178: v4(10.16,38.35) 10.29,38.35 24.32,24.32 v4(43.05,24.32) 43.43,23.94 43.43,8 48.77,2.67 50.67,2.67 PA.17 ; v4(8.43,38.35) v4(8.43,37.35)
PA13: length 72.8
  Top Layer w0.178: v4(20.32,5.72) 20.32,6.98 18.47,8.83 U0.6 ; U1.72 v4(43.56,24.82) ; PA.18 50.16,5.72 v4(35.05,5.72)
  Bottom Layer w0.178: v4(20.32,5.72) v4(35.05,5.72) ; PA.18 48.84,7.04 46.69,7.04 43.81,9.91 43.81,24.57 v4(43.56,24.82)
PA14: length 82.2
  Top Layer w0.178: PA.19 52.07,6.35 v4(35.56,6.35) ; v4(20.96,6.35) 20.96,7.11 18.58,9.48 U0.7 ; U1.76 v4(43.94,27.87)
  Bottom Layer w0.178: v4(43.94,27.87) 44.2,27.62 44.2,10.29 47.12,7.37 51.05,7.37 PA.19 ; v4(20.96,6.35) v4(35.56,6.35)
PB0: length 36.2
  Top Layer w0.178: U1.35 v4(32.79,25.4)
  Bottom Layer w0.178: PB.5 21.59,36.6 v4(32.79,25.4)
PB1: length 35.3
  Top Layer w0.178: U1.36 v4(33.29,25.91)
  Bottom Layer w0.178: PB.6 24.13,35.07 v4(33.29,25.91)
PB2: length 34.5
  Top Layer w0.178: U1.37 v4(33.79,26.42)
  Bottom Layer w0.178: PB.7 26.67,33.54 v4(33.79,26.42)
PB3: length 18.4
  Top Layer w0.178: v4(33.79,32.77) U1.89
  Bottom Layer w0.178: v4(33.79,32.77) 29.21,37.35 PB.8
PB4: length 17.7
  Top Layer w0.178: U1.90 33.29,33.04 v4(33.97,33.72)
  Bottom Layer w0.178: v4(33.97,33.72) 31.75,35.94 PB.9
PB5: length 17.3
  Top Layer w0.178: v4(34.29,34.42) 33.91,34.42 32.79,33.3 U1.91
  Bottom Layer w0.178: PB.10 v4(34.29,34.42)
PB6: length 20
  Top Layer w0.178: U1.92 32.29,33.53 33.69,34.92 v4(36.58,34.92)
  Bottom Layer w0.178: v4(36.58,34.92) 36.83,35.18 PB.11
PB8: length 23.8
  Top Layer w0.178: U1.95 v4(30.79,32.13)
  Bottom Layer w0.178: v4(30.79,32.13) 35.43,32.13 41.91,38.61 PB.13
PB9: length 25.5
  Top Layer w0.178: v4(30.29,31.5) U1.96
  Bottom Layer w0.178: v4(30.29,31.5) 35.69,31.5 44.45,40.26 PB.14
PB10: length 37
  Top Layer w0.178: v4(36.32,25.91) 36.32,16.13 38.79,13.66 U1.47
  Bottom Layer w0.178: PB.15 46.99,41.66 36.32,30.99 v4(36.32,25.91)
PB11: length 37.7
  Top Layer w0.178: U1.48 39.29,13.92 36.96,16.26 v4(36.96,26.42)
  Bottom Layer w0.178: v4(36.96,26.42) 36.96,30.48 49.53,43.05 PB.16
PB12: length 39
  Top Layer w0.178: U1.51 39.66,14.32 37.59,16.38 v4(37.59,25.91)
  Bottom Layer w0.178: v4(37.59,25.91) 37.59,29.84 PB.17
PB13: length 38.9
  Top Layer w0.178: U1.52 39.92,14.82 38.23,16.51 v4(38.23,26.42)
  Bottom Layer w0.178: PB.18 38.23,27.94 v4(38.23,26.42)
PC0: length 29.9
  Top Layer w0.178: v4(18.92,19.69) 18.92,33.45 13.72,38.66 U2.6 ; U1.15 v4(25.65,19.32)
  Bottom Layer w0.178: v4(18.92,19.69) 19.29,19.32 v4(25.65,19.32)
PC1: length 31.3
  Top Layer w0.178: U1.16 v4(25.15,18.82) ; v4(18.41,19.05) 18.41,32.69 12.45,38.66 U2.7
  Bottom Layer w0.178: v4(18.41,19.05) 18.65,18.82 v4(25.15,18.82)
PC2: length 32.4
  Top Layer w0.178: U1.17 v4(24.64,18.32) ; U2.1 11.18,33.22 13.01,35.05 15.49,35.05 17.91,32.64 v4(17.91,18.42)
  Bottom Layer w0.178: v4(17.91,18.42) 18,18.32 v4(24.64,18.32)
PC3: length 31.6
  Top Layer w0.178: U1.18 v4(24.13,17.82) ; v4(17.4,17.78) 17.4,32.51 15.37,34.54 13.21,34.54 12.45,33.78 U2.2
  Bottom Layer w0.178: v4(24.13,17.82) 17.44,17.82 v4(17.4,17.78)
PC4: length 39.3
  Top Layer w0.178: U1.33 31.79,16.34 v4(31.62,16.51) ; U2.3 13.72,33.22 14.53,34.04 15.24,34.04 16.89,32.39 16.89,16.64 v4(17.02,16.51)
  Bottom Layer w0.178: v4(31.62,16.51) v4(17.02,16.51)
PC5: length 42.7
  Top Layer w0.178: U2.5 14.99,38.66 19.43,34.22 19.43,18.16 v4(18.41,17.14) ; v4(32.13,17.14) 32.29,16.99 U1.34
  Bottom Layer w0.178: v4(32.13,17.14) v4(18.41,17.14)
PC8: length 20.8
  Top Layer w0.178: v4(46.23,22.35) 45.2,21.32 U1.65
  Bottom Layer w0.178: v4(46.23,22.35) 46.23,16.89 47.34,15.78 TF.7 48.93,15.78 53.34,20.19 R23.1
PC9: length 20
  Top Layer w0.178: v4(46.74,23.62) 44.93,21.82 U1.66
  Bottom Layer w0.178: v4(46.74,23.62) 46.74,17.4 47.25,16.88 TF.8 49.01,16.88 51.82,19.69 R24.1
PC10: length 45.9
  Top Layer w0.178: v4(44.7,29.59) 39.75,29.59 39.29,29.13 U1.78
  Bottom Layer w0.178: v4(44.7,29.59) 44.96,29.34 44.96,11.56 47.33,9.19 TF.1 48.94,9.19 57.02,17.27 57.02,20.48 57.88,21.34 R20.1
PC11: length 44.8
  Top Layer w0.178: v4(45.09,30.23) 39.62,30.23 38.79,29.39 U1.79
  Bottom Layer w0.178: R21.1 56.39,17.65 49.02,10.28 TF.2 47.37,10.28 45.34,12.32 45.34,29.97 v4(45.09,30.23)
PC12: length 28.3
  Top Layer w0.178: U1.80 38.29,29.65 39.5,30.86 v4(45.72,30.86)
  Bottom Layer w0.178: v4(45.72,30.86) 45.72,15.24 47.38,13.58 TF.5
PD2: length 53.4
  Top Layer w0.178: v4(58.93,32.46) FPC.14 38.81,32.46 36.79,30.44 U1.83
  Bottom Layer w0.178: v4(58.93,32.46) 58.93,22.48 58.55,22.1 55.63,22.1 54.87,21.34 R22.1 54.86,17.27 48.98,11.38 TF.3
PIN19: length 8.5
  Top Layer w0.178: R6.1 R7.1 23.88,14.98 23.88,16.13 25.07,17.32 U1.19
U0_SWC: length 3.6
  Top Layer w0.178: U0.20 12.31,5.58 SWD.1
U0_SWD: length 5.4
  Top Layer w0.178: U0.19 12.2,6.23 12.45,6.48 12.45,8.25 SWD.2
USB0_D+: length 6.8
  Top Layer w0.178: USB0.A6 6.47,7.87 6.22,7.62 6.22,7.11 6.47,6.87 USB0.B6 11.09,6.87 U0.18
USB0_D-: length 5.7
  Top Layer w0.178: USB0.B7 8.39,8.37 8.64,8.13 8.64,7.38 8.62,7.37 ; 8.62,7.37 9.91,7.37 10.07,7.53 U0.17 ; 8.62,7.37 USB0.A7
X32_IN: length 6.2
  Top Layer w0.178: C12.1 22.87,25.46 Y32K.1 23.41,22.82 U1.8
X32_OUT: length 9.3
  Top Layer w0.178: U1.9 25.5,22.32 25.15,21.97 21.59,21.97 20.31,23.25 Y32K.2 20.31,25.46 C13.2
XIN: length 6.5
  Top Layer w0.178: Y8M.1 22.86,17.78 C10.1 22.91,19.62 24.11,20.82 U1.12
XOUT: length 11.6
  Top Layer w0.178: v4(25.15,20.19) 25.27,20.32 U1.13 ; Y8M.3 20.74,15.91 21.59,16.76 21.59,18.4 20.37,19.62 C11.2 20.89,20.19 v4(21.21,20.19)
  Bottom Layer w0.178: v4(25.15,20.19) v4(21.21,20.19)
$1N5592: length 7.2
  Top Layer w0.178: R11.1 4.21,10.91 6.24,8.87 USB0.A5
$1N5593: length 6.7
  Top Layer w0.178: R10.1 4.21,3.83 6.25,5.87 USB0.B5
$1N5603: length 1.7
  Top Layer w0.508: PWR.2 13.93,25.15 R0.1
$1N5607: length 7.2
  Top Layer w0.178: R13.1 4.21,41.39 6.24,39.35 USB1.A5
$1N5608: length 6.7
  Top Layer w0.178: R12.1 4.21,34.31 6.25,36.35 USB1.B5
$1N5646: length 9
  Top Layer w0.178: C7.1 33.91,10.8 v4(33.66,11.05) ; U1.49 v4(39.79,11.68)
  Bottom Layer w0.178: v4(39.79,11.68) 34.29,11.68 v4(33.66,11.05)
$1N5664: length 3.2
  Top Layer w0.178: C8.2 44.97,25.32 U1.73
$1N5769: length 18.6
  Top Layer w0.178: v4(27.31,35.56) 22.99,31.24 21.34,31.24 20.32,30.23 R8.2 ; U1.94 v4(31.29,29.72)
  Bottom Layer w0.178: v4(27.31,35.56) 27.31,33.66 31.24,29.72 v4(31.29,29.72)
$1N55185: length 1.8
  Top Layer w0.508: R1.1 13.93,20.57 UTX.2
$1N55189: length 1.8
  Top Layer w0.508: R2.1 13.93,22.86 URX.2
$1N55194: length 1.7
  Top Layer w0.508: R3.1 13.93,29.72 LED1.2
$1N55209: length 1.7
  Top Layer w0.508: LED2.2 13.93,27.43 R4.1
$2N25575: length 12.4
  Top Layer w0.178: R18.2 v4(12.18,13.08) ; U0.1 v4(13.34,5.58)
  Bottom Layer w0.178: v4(12.18,13.08) 12.18,6.23 12.83,5.58 v4(13.34,5.58)
$2N25582: length 12.6
  Top Layer w0.178: U0.4 v4(15.62,7.53)
  Top Layer w0.508: C19.2 R19.1
  Bottom Layer w0.178: v4(15.62,7.53) 15.62,11.68 14.1,13.21 14.1,14.99 v1(13.08,16)

## Text on the board
Bottom Silkscreen Layer: D | C | PA15 => JTAG_TDI / PB3  => JTAG_TDO / PB7  => FSMC_NADV / PD2  => SDIO_CMD & FPC40
Top Silkscreen Layer: B14 | B15 | A15 | 5V | GND | B0 | 1 | 2 | 3 | 4 | 5 | 6 | 7 | 8 | 9 | 10 | 11 | 12 | 13 | 14 | 15 | 3V3 | A0 | T | R | N | P | D | C | STM32VG
